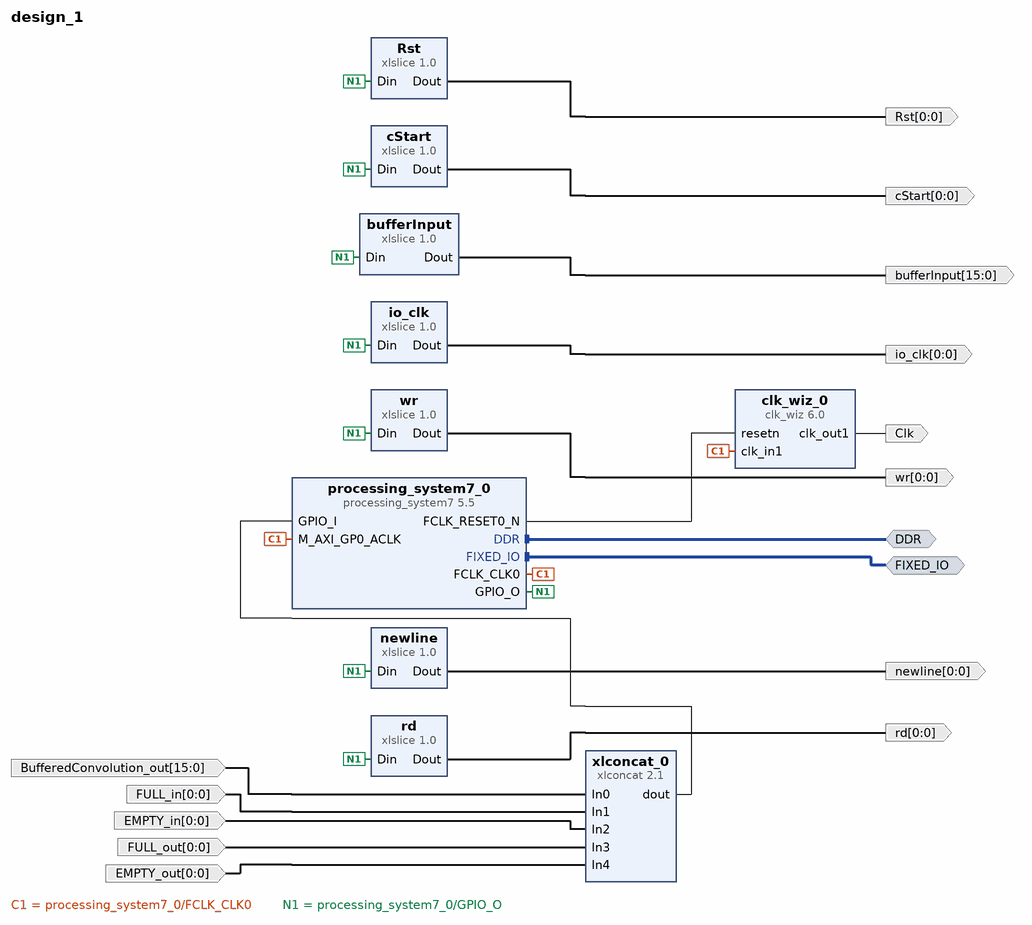
[diagram p0: block diagram of the top level]
# Vivado block design design_1, xc7z020clg400-1, Vivado 2019.2
create_bd_design design_1

create_bd_intf_port -mode Master -vlnv xilinx.com:interface:ddrx_rtl:1.0 DDR
create_bd_intf_port -mode Master -vlnv xilinx.com:display_processing_system7:fixedio_rtl:1.0 FIXED_IO
create_bd_port -dir I -from 0 -to 0 FULL_out
create_bd_port -dir I -from 0 -to 0 EMPTY_in
create_bd_port -dir O -from 0 -to 0 Rst
create_bd_port -dir I -from 0 -to 0 FULL_in
create_bd_port -dir O -from 0 -to 0 cStart
create_bd_port -dir O -from 15 -to 0 bufferInput
create_bd_port -dir I -from 15 -to 0 BufferedConvolution_out
create_bd_port -dir O -from 0 -to 0 io_clk
create_bd_port -dir O -from 0 -to 0 wr
create_bd_port -dir O -type clk Clk
set_property -dict {CONFIG.FREQ_HZ 50000000} [get_bd_ports Clk]
create_bd_port -dir O -from 0 -to 0 newline
create_bd_port -dir O -from 0 -to 0 rd
create_bd_port -dir I -from 0 -to 0 EMPTY_out

create_bd_cell -type ip -vlnv xilinx.com:ip:xlslice:1.0 Rst
set_property -dict {CONFIG.DIN_FROM 20 CONFIG.DIN_TO 20 CONFIG.DIN_WIDTH 42 CONFIG.DOUT_WIDTH 1} [get_bd_cells Rst]
create_bd_cell -type ip -vlnv xilinx.com:ip:xlslice:1.0 cStart
set_property -dict {CONFIG.DIN_FROM 37 CONFIG.DIN_TO 37 CONFIG.DIN_WIDTH 42 CONFIG.DOUT_WIDTH 1} [get_bd_cells cStart]
create_bd_cell -type ip -vlnv xilinx.com:ip:xlslice:1.0 bufferInput
set_property -dict {CONFIG.DIN_FROM 36 CONFIG.DIN_TO 21 CONFIG.DIN_WIDTH 42 CONFIG.DOUT_WIDTH 16} [get_bd_cells bufferInput]
create_bd_cell -type ip -vlnv xilinx.com:ip:processing_system7:5.5 processing_system7_0
set_property -dict [list \
  CONFIG.PCW_APU_PERIPHERAL_FREQMHZ 650 \
  CONFIG.PCW_CRYSTAL_PERIPHERAL_FREQMHZ 50 \
  CONFIG.PCW_ENET0_ENET0_IO {MIO 16 .. 27} \
  CONFIG.PCW_ENET0_GRP_MDIO_ENABLE 1 \
  CONFIG.PCW_ENET0_GRP_MDIO_IO {MIO 52 .. 53} \
  CONFIG.PCW_ENET0_PERIPHERAL_ENABLE 1 \
  CONFIG.PCW_FPGA0_PERIPHERAL_FREQMHZ 100 \
  CONFIG.PCW_FPGA1_PERIPHERAL_FREQMHZ 50 \
  CONFIG.PCW_GPIO_EMIO_GPIO_ENABLE 1 \
  CONFIG.PCW_GPIO_EMIO_GPIO_IO 42 \
  CONFIG.PCW_GPIO_EMIO_GPIO_WIDTH 42 \
  CONFIG.PCW_GPIO_MIO_GPIO_ENABLE 0 \
  CONFIG.PCW_M_AXI_GP0_FREQMHZ 10 \
  CONFIG.PCW_PERIPHERAL_BOARD_PRESET part0 \
  CONFIG.PCW_PRESET_BANK1_VOLTAGE {LVCMOS 1.8V} \
  CONFIG.PCW_QSPI_GRP_FBCLK_ENABLE 1 \
  CONFIG.PCW_QSPI_GRP_FBCLK_IO {MIO 8} \
  CONFIG.PCW_QSPI_GRP_SINGLE_SS_ENABLE 1 \
  CONFIG.PCW_QSPI_GRP_SINGLE_SS_IO {MIO 1 .. 6} \
  CONFIG.PCW_QSPI_PERIPHERAL_ENABLE 1 \
  CONFIG.PCW_QSPI_QSPI_IO {MIO 1 .. 6} \
  CONFIG.PCW_SD0_GRP_CD_ENABLE 1 \
  CONFIG.PCW_SD0_GRP_CD_IO {MIO 47} \
  CONFIG.PCW_SD0_GRP_WP_ENABLE 0 \
  CONFIG.PCW_SD0_PERIPHERAL_ENABLE 1 \
  CONFIG.PCW_SD0_SD0_IO {MIO 40 .. 45} \
  CONFIG.PCW_SDIO_PERIPHERAL_FREQMHZ 50 \
  CONFIG.PCW_SINGLE_QSPI_DATA_MODE x4 \
  CONFIG.PCW_UART0_PERIPHERAL_ENABLE 1 \
  CONFIG.PCW_UART0_UART0_IO {MIO 14 .. 15} \
  CONFIG.PCW_UART1_PERIPHERAL_ENABLE 0 \
  CONFIG.PCW_UART_PERIPHERAL_FREQMHZ 100 \
  CONFIG.PCW_UIPARAM_DDR_BUS_WIDTH {16 Bit} \
  CONFIG.PCW_UIPARAM_DDR_FREQ_MHZ 525 \
  CONFIG.PCW_UIPARAM_DDR_PARTNO {MT41J256M16 RE-125} \
  CONFIG.PCW_USB0_PERIPHERAL_ENABLE 1 \
  CONFIG.PCW_USB0_USB0_IO {MIO 28 .. 39} \
] [get_bd_cells processing_system7_0]
# 464 more settings of processing_system7_0 are not shown: defaults, MIO pin electricals, DDR timing, and values the tool derives
create_bd_cell -type ip -vlnv xilinx.com:ip:xlslice:1.0 io_clk
set_property -dict {CONFIG.DIN_FROM 41 CONFIG.DIN_TO 41 CONFIG.DIN_WIDTH 42 CONFIG.DOUT_WIDTH 1} [get_bd_cells io_clk]
create_bd_cell -type ip -vlnv xilinx.com:ip:xlconcat:2.1 xlconcat_0
set_property -dict [list \
  CONFIG.IN0_WIDTH 16 \
  CONFIG.IN1_WIDTH 1 \
  CONFIG.IN2_WIDTH 1 \
  CONFIG.IN3_WIDTH 1 \
  CONFIG.IN4_WIDTH 1 \
  CONFIG.NUM_PORTS 5 \
] [get_bd_cells xlconcat_0]
create_bd_cell -type ip -vlnv xilinx.com:ip:xlslice:1.0 wr
set_property -dict {CONFIG.DIN_FROM 39 CONFIG.DIN_TO 39 CONFIG.DIN_WIDTH 42 CONFIG.DOUT_WIDTH 1} [get_bd_cells wr]
create_bd_cell -type ip -vlnv xilinx.com:ip:clk_wiz:6.0 clk_wiz_0
set_property -dict [list \
  CONFIG.CLKOUT1_JITTER 151.636 \
  CONFIG.CLKOUT1_REQUESTED_OUT_FREQ 50 \
  CONFIG.MMCM_CLKOUT0_DIVIDE_F 20.000 \
  CONFIG.RESET_PORT resetn \
  CONFIG.RESET_TYPE ACTIVE_LOW \
  CONFIG.USE_LOCKED false \
] [get_bd_cells clk_wiz_0]
create_bd_cell -type ip -vlnv xilinx.com:ip:xlslice:1.0 newline
set_property -dict {CONFIG.DIN_FROM 38 CONFIG.DIN_TO 38 CONFIG.DIN_WIDTH 42 CONFIG.DOUT_WIDTH 1} [get_bd_cells newline]
create_bd_cell -type ip -vlnv xilinx.com:ip:xlslice:1.0 rd
set_property -dict {CONFIG.DIN_FROM 40 CONFIG.DIN_TO 40 CONFIG.DIN_WIDTH 42 CONFIG.DOUT_WIDTH 1} [get_bd_cells rd]

# ---- connections ----

connect_bd_intf_net [get_bd_intf_ports FIXED_IO] [get_bd_intf_pins processing_system7_0/FIXED_IO]
connect_bd_intf_net [get_bd_intf_ports DDR] [get_bd_intf_pins processing_system7_0/DDR]
connect_bd_net -net In0_0_1 [get_bd_ports BufferedConvolution_out] [get_bd_pins xlconcat_0/In0]
connect_bd_net -net In1_0_1 [get_bd_ports FULL_in] [get_bd_pins xlconcat_0/In1]
connect_bd_net -net In2_0_1 [get_bd_ports EMPTY_in] [get_bd_pins xlconcat_0/In2]
connect_bd_net -net In3_0_1 [get_bd_ports FULL_out] [get_bd_pins xlconcat_0/In3]
connect_bd_net [get_bd_pins Rst/Dout] [get_bd_ports Rst]
connect_bd_net [get_bd_pins cStart/Dout] [get_bd_ports cStart]
connect_bd_net -net dataInput_Dout [get_bd_pins bufferInput/Dout] [get_bd_ports bufferInput]
connect_bd_net [get_bd_pins processing_system7_0/FCLK_CLK0] [get_bd_pins processing_system7_0/M_AXI_GP0_ACLK] [get_bd_pins clk_wiz_0/clk_in1]
connect_bd_net [get_bd_pins processing_system7_0/GPIO_O] \
  [get_bd_pins Rst/Din] [get_bd_pins bufferInput/Din] [get_bd_pins cStart/Din] [get_bd_pins io_clk/Din] [get_bd_pins wr/Din] \
  [get_bd_pins newline/Din] [get_bd_pins rd/Din]
connect_bd_net -net wr_clk_Dout [get_bd_pins io_clk/Dout] [get_bd_ports io_clk]
connect_bd_net [get_bd_pins xlconcat_0/dout] [get_bd_pins processing_system7_0/GPIO_I]
connect_bd_net -net wr_clk1_Dout [get_bd_pins wr/Dout] [get_bd_ports wr]
connect_bd_net [get_bd_pins processing_system7_0/FCLK_RESET0_N] [get_bd_pins clk_wiz_0/resetn]
connect_bd_net [get_bd_pins clk_wiz_0/clk_out1] [get_bd_ports Clk]
connect_bd_net [get_bd_pins newline/Dout] [get_bd_ports newline]
connect_bd_net [get_bd_pins rd/Dout] [get_bd_ports rd]
connect_bd_net -net In4_0_1 [get_bd_ports EMPTY_out] [get_bd_pins xlconcat_0/In4]

validate_bd_design
save_bd_design
